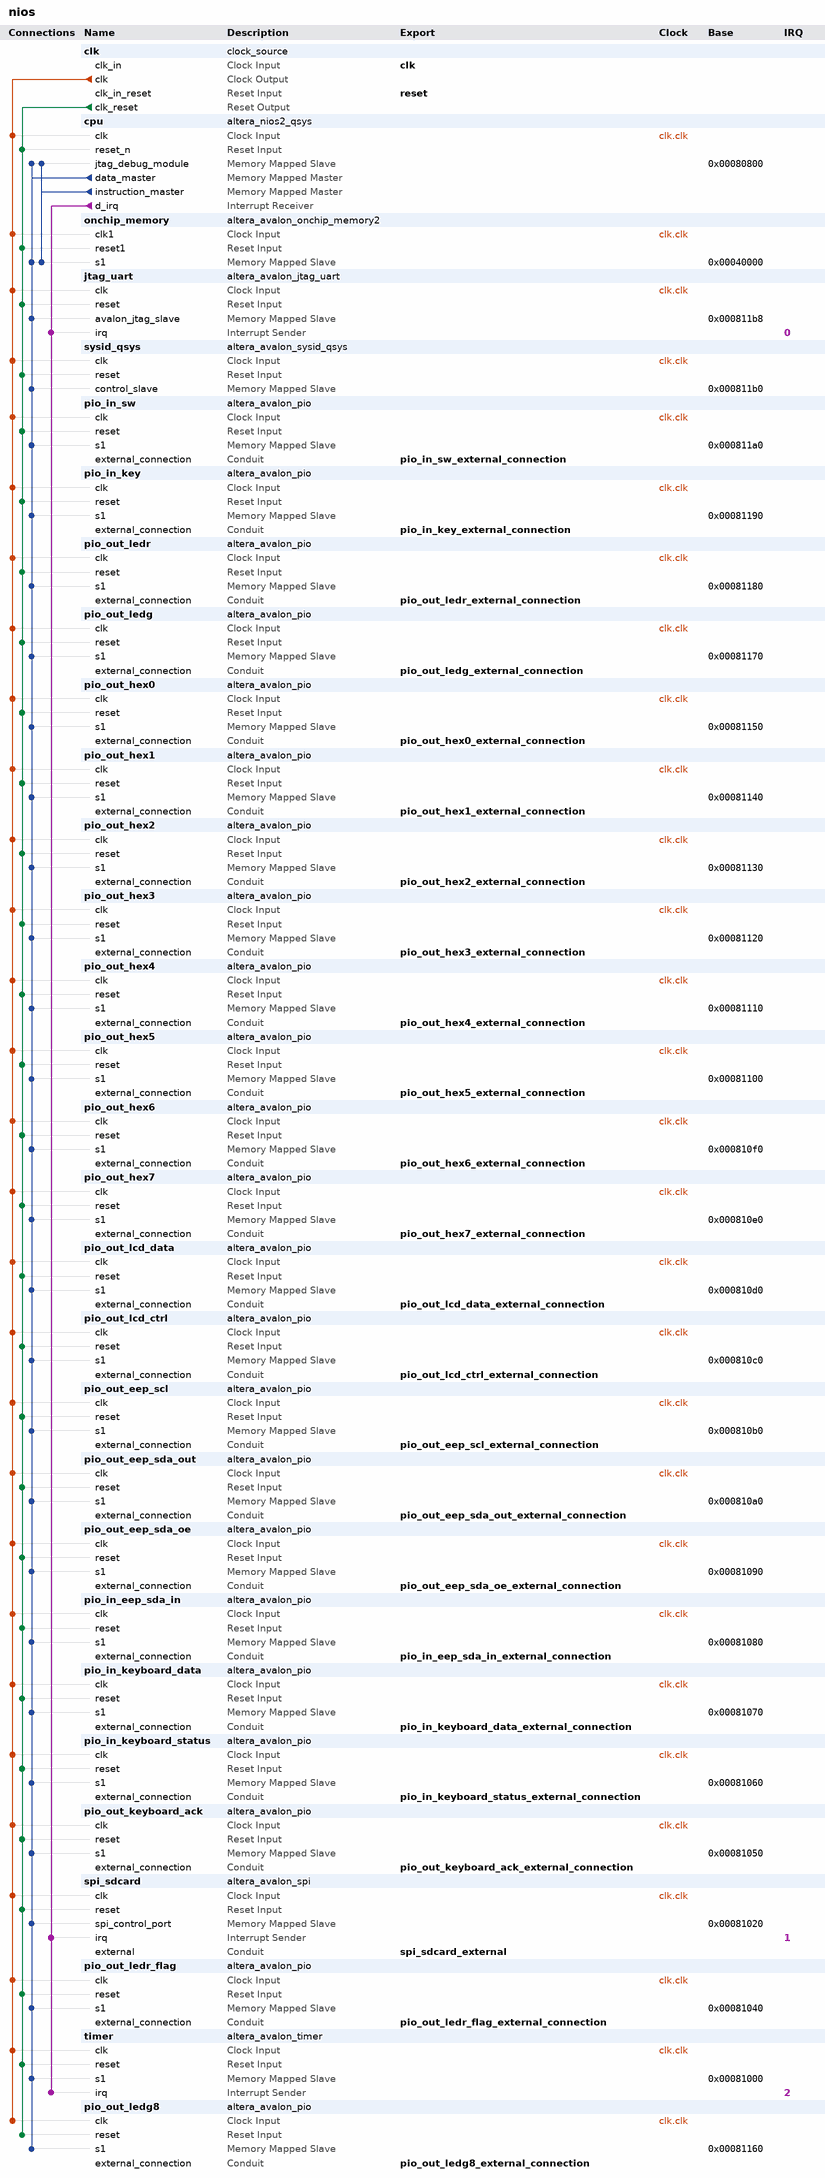
[diagram p0: system contents]
# Platform Designer (Qsys) system nios, Cyclone IV E EP4CE115F29C7
# Parameters at their usual value, and those the tool derives, are not listed.
package require -exact qsys 13.1
create_system nios
set_project_property DEVICE_FAMILY {Cyclone IV E}
set_project_property DEVICE EP4CE115F29C7

add_instance clk clock_source 13.1
set_instance_parameter_value clk clockFrequency 50000000

add_instance cpu altera_nios2_qsys 13.1
set_instance_parameter_value cpu resetSlave onchip_memory.s1
set_instance_parameter_value cpu mmu_TLBMissExcSlave None
set_instance_parameter_value cpu exceptionSlave onchip_memory.s1
set_instance_parameter_value cpu breakSlave cpu.jtag_debug_module
set_instance_parameter_value cpu impl Tiny
set_instance_parameter_value cpu icache_size 4096

add_instance onchip_memory altera_avalon_onchip_memory2 13.1
set_instance_parameter_value onchip_memory dataWidth 32
set_instance_parameter_value onchip_memory dualPort false
set_instance_parameter_value onchip_memory initMemContent true
set_instance_parameter_value onchip_memory initializationFileName onchip_mem.hex
set_instance_parameter_value onchip_memory memorySize 262144

add_instance jtag_uart altera_avalon_jtag_uart 13.1
set_instance_parameter_value jtag_uart simInteractiveOptions NO_INTERACTIVE_WINDOWS

add_instance sysid_qsys altera_avalon_sysid_qsys 13.1
set_instance_parameter_value sysid_qsys id 260

add_instance pio_in_sw altera_avalon_pio 13.1
set_instance_parameter_value pio_in_sw direction Input
set_instance_parameter_value pio_in_sw width 18

add_instance pio_in_key altera_avalon_pio 13.1
set_instance_parameter_value pio_in_key direction Input
set_instance_parameter_value pio_in_key width 4

add_instance pio_out_ledr altera_avalon_pio 13.1
set_instance_parameter_value pio_out_ledr direction Output
set_instance_parameter_value pio_out_ledr width 18

add_instance pio_out_ledg altera_avalon_pio 13.1
set_instance_parameter_value pio_out_ledg direction Output
set_instance_parameter_value pio_out_ledg width 8

add_instance pio_out_hex0 altera_avalon_pio 13.1
set_instance_parameter_value pio_out_hex0 direction Output
set_instance_parameter_value pio_out_hex0 width 8

add_instance pio_out_hex1 altera_avalon_pio 13.1
set_instance_parameter_value pio_out_hex1 direction Output
set_instance_parameter_value pio_out_hex1 width 8

add_instance pio_out_hex2 altera_avalon_pio 13.1
set_instance_parameter_value pio_out_hex2 direction Output
set_instance_parameter_value pio_out_hex2 width 8

add_instance pio_out_hex3 altera_avalon_pio 13.1
set_instance_parameter_value pio_out_hex3 direction Output
set_instance_parameter_value pio_out_hex3 width 8

add_instance pio_out_hex4 altera_avalon_pio 13.1
set_instance_parameter_value pio_out_hex4 direction Output
set_instance_parameter_value pio_out_hex4 width 8

add_instance pio_out_hex5 altera_avalon_pio 13.1
set_instance_parameter_value pio_out_hex5 direction Output
set_instance_parameter_value pio_out_hex5 width 8

add_instance pio_out_hex6 altera_avalon_pio 13.1
set_instance_parameter_value pio_out_hex6 direction Output
set_instance_parameter_value pio_out_hex6 width 8

add_instance pio_out_hex7 altera_avalon_pio 13.1
set_instance_parameter_value pio_out_hex7 direction Output
set_instance_parameter_value pio_out_hex7 width 8

add_instance pio_out_lcd_data altera_avalon_pio 13.1
set_instance_parameter_value pio_out_lcd_data direction Output
set_instance_parameter_value pio_out_lcd_data width 8

add_instance pio_out_lcd_ctrl altera_avalon_pio 13.1
set_instance_parameter_value pio_out_lcd_ctrl direction Output
set_instance_parameter_value pio_out_lcd_ctrl width 5

add_instance pio_out_eep_scl altera_avalon_pio 13.1
set_instance_parameter_value pio_out_eep_scl direction Output
set_instance_parameter_value pio_out_eep_scl width 1

add_instance pio_out_eep_sda_out altera_avalon_pio 13.1
set_instance_parameter_value pio_out_eep_sda_out direction Output
set_instance_parameter_value pio_out_eep_sda_out width 1

add_instance pio_out_eep_sda_oe altera_avalon_pio 13.1
set_instance_parameter_value pio_out_eep_sda_oe direction Output
set_instance_parameter_value pio_out_eep_sda_oe width 1

add_instance pio_in_eep_sda_in altera_avalon_pio 13.1
set_instance_parameter_value pio_in_eep_sda_in direction Input
set_instance_parameter_value pio_in_eep_sda_in width 1

add_instance pio_in_keyboard_data altera_avalon_pio 13.1
set_instance_parameter_value pio_in_keyboard_data direction Input
set_instance_parameter_value pio_in_keyboard_data width 8

add_instance pio_in_keyboard_status altera_avalon_pio 13.1
set_instance_parameter_value pio_in_keyboard_status direction Input
set_instance_parameter_value pio_in_keyboard_status width 8

add_instance pio_out_keyboard_ack altera_avalon_pio 13.1
set_instance_parameter_value pio_out_keyboard_ack direction Output
set_instance_parameter_value pio_out_keyboard_ack width 1

add_instance spi_sdcard altera_avalon_spi 13.1
set_instance_parameter_value spi_sdcard clockPolarity 0
set_instance_parameter_value spi_sdcard dataWidth 8
set_instance_parameter_value spi_sdcard masterSPI true
set_instance_parameter_value spi_sdcard numberOfSlaves 1
set_instance_parameter_value spi_sdcard targetClockRate 4000

add_instance pio_out_ledr_flag altera_avalon_pio 13.1
set_instance_parameter_value pio_out_ledr_flag direction Output
set_instance_parameter_value pio_out_ledr_flag width 8

add_instance timer altera_avalon_timer 13.1
set_instance_parameter_value timer period 1
set_instance_parameter_value timer periodUnits MSEC

add_instance pio_out_ledg8 altera_avalon_pio 13.1
set_instance_parameter_value pio_out_ledg8 direction Output
set_instance_parameter_value pio_out_ledg8 width 1

# connections
add_connection clk.clk cpu.clk clock
add_connection clk.clk jtag_uart.clk clock
add_connection clk.clk onchip_memory.clk1 clock
add_connection clk.clk pio_in_eep_sda_in.clk clock
add_connection clk.clk pio_in_key.clk clock
add_connection clk.clk pio_in_keyboard_data.clk clock
add_connection clk.clk pio_in_keyboard_status.clk clock
add_connection clk.clk pio_in_sw.clk clock
add_connection clk.clk pio_out_eep_scl.clk clock
add_connection clk.clk pio_out_eep_sda_oe.clk clock
add_connection clk.clk pio_out_eep_sda_out.clk clock
add_connection clk.clk pio_out_hex0.clk clock
add_connection clk.clk pio_out_hex1.clk clock
add_connection clk.clk pio_out_hex2.clk clock
add_connection clk.clk pio_out_hex3.clk clock
add_connection clk.clk pio_out_hex4.clk clock
add_connection clk.clk pio_out_hex5.clk clock
add_connection clk.clk pio_out_hex6.clk clock
add_connection clk.clk pio_out_hex7.clk clock
add_connection clk.clk pio_out_keyboard_ack.clk clock
add_connection clk.clk pio_out_lcd_ctrl.clk clock
add_connection clk.clk pio_out_lcd_data.clk clock
add_connection clk.clk pio_out_ledg8.clk clock
add_connection clk.clk pio_out_ledg.clk clock
add_connection clk.clk pio_out_ledr.clk clock
add_connection clk.clk pio_out_ledr_flag.clk clock
add_connection clk.clk spi_sdcard.clk clock
add_connection clk.clk sysid_qsys.clk clock
add_connection clk.clk timer.clk clock
add_connection clk.clk_reset cpu.reset_n reset
add_connection clk.clk_reset jtag_uart.reset reset
add_connection clk.clk_reset onchip_memory.reset1 reset
add_connection clk.clk_reset pio_in_eep_sda_in.reset reset
add_connection clk.clk_reset pio_in_key.reset reset
add_connection clk.clk_reset pio_in_keyboard_data.reset reset
add_connection clk.clk_reset pio_in_keyboard_status.reset reset
add_connection clk.clk_reset pio_in_sw.reset reset
add_connection clk.clk_reset pio_out_eep_scl.reset reset
add_connection clk.clk_reset pio_out_eep_sda_oe.reset reset
add_connection clk.clk_reset pio_out_eep_sda_out.reset reset
add_connection clk.clk_reset pio_out_hex0.reset reset
add_connection clk.clk_reset pio_out_hex1.reset reset
add_connection clk.clk_reset pio_out_hex2.reset reset
add_connection clk.clk_reset pio_out_hex3.reset reset
add_connection clk.clk_reset pio_out_hex4.reset reset
add_connection clk.clk_reset pio_out_hex5.reset reset
add_connection clk.clk_reset pio_out_hex6.reset reset
add_connection clk.clk_reset pio_out_hex7.reset reset
add_connection clk.clk_reset pio_out_keyboard_ack.reset reset
add_connection clk.clk_reset pio_out_lcd_ctrl.reset reset
add_connection clk.clk_reset pio_out_lcd_data.reset reset
add_connection clk.clk_reset pio_out_ledg8.reset reset
add_connection clk.clk_reset pio_out_ledg.reset reset
add_connection clk.clk_reset pio_out_ledr.reset reset
add_connection clk.clk_reset pio_out_ledr_flag.reset reset
add_connection clk.clk_reset spi_sdcard.reset reset
add_connection clk.clk_reset sysid_qsys.reset reset
add_connection clk.clk_reset timer.reset reset
add_connection cpu.data_master cpu.jtag_debug_module avalon
set_connection_parameter_value cpu.data_master/cpu.jtag_debug_module baseAddress 0x00080800
add_connection cpu.data_master jtag_uart.avalon_jtag_slave avalon
set_connection_parameter_value cpu.data_master/jtag_uart.avalon_jtag_slave baseAddress 0x000811b8
add_connection cpu.data_master onchip_memory.s1 avalon
set_connection_parameter_value cpu.data_master/onchip_memory.s1 baseAddress 0x00040000
add_connection cpu.data_master pio_in_eep_sda_in.s1 avalon
set_connection_parameter_value cpu.data_master/pio_in_eep_sda_in.s1 baseAddress 0x00081080
add_connection cpu.data_master pio_in_key.s1 avalon
set_connection_parameter_value cpu.data_master/pio_in_key.s1 baseAddress 0x00081190
add_connection cpu.data_master pio_in_keyboard_data.s1 avalon
set_connection_parameter_value cpu.data_master/pio_in_keyboard_data.s1 baseAddress 0x00081070
add_connection cpu.data_master pio_in_keyboard_status.s1 avalon
set_connection_parameter_value cpu.data_master/pio_in_keyboard_status.s1 baseAddress 0x00081060
add_connection cpu.data_master pio_in_sw.s1 avalon
set_connection_parameter_value cpu.data_master/pio_in_sw.s1 baseAddress 0x000811a0
add_connection cpu.data_master pio_out_eep_scl.s1 avalon
set_connection_parameter_value cpu.data_master/pio_out_eep_scl.s1 baseAddress 0x000810b0
add_connection cpu.data_master pio_out_eep_sda_oe.s1 avalon
set_connection_parameter_value cpu.data_master/pio_out_eep_sda_oe.s1 baseAddress 0x00081090
add_connection cpu.data_master pio_out_eep_sda_out.s1 avalon
set_connection_parameter_value cpu.data_master/pio_out_eep_sda_out.s1 baseAddress 0x000810a0
add_connection cpu.data_master pio_out_hex0.s1 avalon
set_connection_parameter_value cpu.data_master/pio_out_hex0.s1 baseAddress 0x00081150
add_connection cpu.data_master pio_out_hex1.s1 avalon
set_connection_parameter_value cpu.data_master/pio_out_hex1.s1 baseAddress 0x00081140
add_connection cpu.data_master pio_out_hex2.s1 avalon
set_connection_parameter_value cpu.data_master/pio_out_hex2.s1 baseAddress 0x00081130
add_connection cpu.data_master pio_out_hex3.s1 avalon
set_connection_parameter_value cpu.data_master/pio_out_hex3.s1 baseAddress 0x00081120
add_connection cpu.data_master pio_out_hex4.s1 avalon
set_connection_parameter_value cpu.data_master/pio_out_hex4.s1 baseAddress 0x00081110
add_connection cpu.data_master pio_out_hex5.s1 avalon
set_connection_parameter_value cpu.data_master/pio_out_hex5.s1 baseAddress 0x00081100
add_connection cpu.data_master pio_out_hex6.s1 avalon
set_connection_parameter_value cpu.data_master/pio_out_hex6.s1 baseAddress 0x000810f0
add_connection cpu.data_master pio_out_hex7.s1 avalon
set_connection_parameter_value cpu.data_master/pio_out_hex7.s1 baseAddress 0x000810e0
add_connection cpu.data_master pio_out_keyboard_ack.s1 avalon
set_connection_parameter_value cpu.data_master/pio_out_keyboard_ack.s1 baseAddress 0x00081050
add_connection cpu.data_master pio_out_lcd_ctrl.s1 avalon
set_connection_parameter_value cpu.data_master/pio_out_lcd_ctrl.s1 baseAddress 0x000810c0
add_connection cpu.data_master pio_out_lcd_data.s1 avalon
set_connection_parameter_value cpu.data_master/pio_out_lcd_data.s1 baseAddress 0x000810d0
add_connection cpu.data_master pio_out_ledg8.s1 avalon
set_connection_parameter_value cpu.data_master/pio_out_ledg8.s1 baseAddress 0x00081160
add_connection cpu.data_master pio_out_ledg.s1 avalon
set_connection_parameter_value cpu.data_master/pio_out_ledg.s1 baseAddress 0x00081170
add_connection cpu.data_master pio_out_ledr.s1 avalon
set_connection_parameter_value cpu.data_master/pio_out_ledr.s1 baseAddress 0x00081180
add_connection cpu.data_master pio_out_ledr_flag.s1 avalon
set_connection_parameter_value cpu.data_master/pio_out_ledr_flag.s1 baseAddress 0x00081040
add_connection cpu.data_master spi_sdcard.spi_control_port avalon
set_connection_parameter_value cpu.data_master/spi_sdcard.spi_control_port baseAddress 0x00081020
add_connection cpu.data_master sysid_qsys.control_slave avalon
set_connection_parameter_value cpu.data_master/sysid_qsys.control_slave baseAddress 0x000811b0
add_connection cpu.data_master timer.s1 avalon
set_connection_parameter_value cpu.data_master/timer.s1 baseAddress 0x00081000
add_connection cpu.instruction_master cpu.jtag_debug_module avalon
set_connection_parameter_value cpu.instruction_master/cpu.jtag_debug_module baseAddress 0x00080800
add_connection cpu.instruction_master onchip_memory.s1 avalon
set_connection_parameter_value cpu.instruction_master/onchip_memory.s1 baseAddress 0x00040000
add_connection cpu.d_irq jtag_uart.irq interrupt
set_connection_parameter_value cpu.d_irq/jtag_uart.irq irqNumber 0
add_connection cpu.d_irq spi_sdcard.irq interrupt
set_connection_parameter_value cpu.d_irq/spi_sdcard.irq irqNumber 1
add_connection cpu.d_irq timer.irq interrupt
set_connection_parameter_value cpu.d_irq/timer.irq irqNumber 2

# exported interfaces
add_interface clk clock sink
set_interface_property clk EXPORT_OF clk.clk_in
add_interface reset reset sink
set_interface_property reset EXPORT_OF clk.clk_in_reset
add_interface pio_in_eep_sda_in_external_connection conduit end
set_interface_property pio_in_eep_sda_in_external_connection EXPORT_OF pio_in_eep_sda_in.external_connection
add_interface pio_out_eep_sda_oe_external_connection conduit end
set_interface_property pio_out_eep_sda_oe_external_connection EXPORT_OF pio_out_eep_sda_oe.external_connection
add_interface pio_out_eep_sda_out_external_connection conduit end
set_interface_property pio_out_eep_sda_out_external_connection EXPORT_OF pio_out_eep_sda_out.external_connection
add_interface pio_out_eep_scl_external_connection conduit end
set_interface_property pio_out_eep_scl_external_connection EXPORT_OF pio_out_eep_scl.external_connection
add_interface pio_out_lcd_ctrl_external_connection conduit end
set_interface_property pio_out_lcd_ctrl_external_connection EXPORT_OF pio_out_lcd_ctrl.external_connection
add_interface pio_out_lcd_data_external_connection conduit end
set_interface_property pio_out_lcd_data_external_connection EXPORT_OF pio_out_lcd_data.external_connection
add_interface pio_out_hex7_external_connection conduit end
set_interface_property pio_out_hex7_external_connection EXPORT_OF pio_out_hex7.external_connection
add_interface pio_out_hex6_external_connection conduit end
set_interface_property pio_out_hex6_external_connection EXPORT_OF pio_out_hex6.external_connection
add_interface pio_out_hex5_external_connection conduit end
set_interface_property pio_out_hex5_external_connection EXPORT_OF pio_out_hex5.external_connection
add_interface pio_out_hex4_external_connection conduit end
set_interface_property pio_out_hex4_external_connection EXPORT_OF pio_out_hex4.external_connection
add_interface pio_out_hex3_external_connection conduit end
set_interface_property pio_out_hex3_external_connection EXPORT_OF pio_out_hex3.external_connection
add_interface pio_out_hex2_external_connection conduit end
set_interface_property pio_out_hex2_external_connection EXPORT_OF pio_out_hex2.external_connection
add_interface pio_out_hex1_external_connection conduit end
set_interface_property pio_out_hex1_external_connection EXPORT_OF pio_out_hex1.external_connection
add_interface pio_out_hex0_external_connection conduit end
set_interface_property pio_out_hex0_external_connection EXPORT_OF pio_out_hex0.external_connection
add_interface pio_out_ledg_external_connection conduit end
set_interface_property pio_out_ledg_external_connection EXPORT_OF pio_out_ledg.external_connection
add_interface pio_out_ledg8_external_connection conduit end
set_interface_property pio_out_ledg8_external_connection EXPORT_OF pio_out_ledg8.external_connection
add_interface pio_out_ledr_external_connection conduit end
set_interface_property pio_out_ledr_external_connection EXPORT_OF pio_out_ledr.external_connection
add_interface pio_in_key_external_connection conduit end
set_interface_property pio_in_key_external_connection EXPORT_OF pio_in_key.external_connection
add_interface pio_in_sw_external_connection conduit end
set_interface_property pio_in_sw_external_connection EXPORT_OF pio_in_sw.external_connection
add_interface pio_in_keyboard_data_external_connection conduit end
set_interface_property pio_in_keyboard_data_external_connection EXPORT_OF pio_in_keyboard_data.external_connection
add_interface pio_in_keyboard_status_external_connection conduit end
set_interface_property pio_in_keyboard_status_external_connection EXPORT_OF pio_in_keyboard_status.external_connection
add_interface pio_out_keyboard_ack_external_connection conduit end
set_interface_property pio_out_keyboard_ack_external_connection EXPORT_OF pio_out_keyboard_ack.external_connection
add_interface spi_sdcard_external conduit end
set_interface_property spi_sdcard_external EXPORT_OF spi_sdcard.external
add_interface pio_out_ledr_flag_external_connection conduit end
set_interface_property pio_out_ledr_flag_external_connection EXPORT_OF pio_out_ledr_flag.external_connection

set_interconnect_requirement {$system} qsys_mm.clockCrossingAdapter HANDSHAKE
set_interconnect_requirement {$system} qsys_mm.maxAdditionalLatency 1
set_interconnect_requirement {$system} qsys_mm.insertDefaultSlave false

save_system nios.qsys
